# Altium schematic sheet Connectors.SchDoc: Frame13ProDock
size A3; DrawnBy: ExoticDG / Nova; SheetNumber: 3; SheetTotal: 5
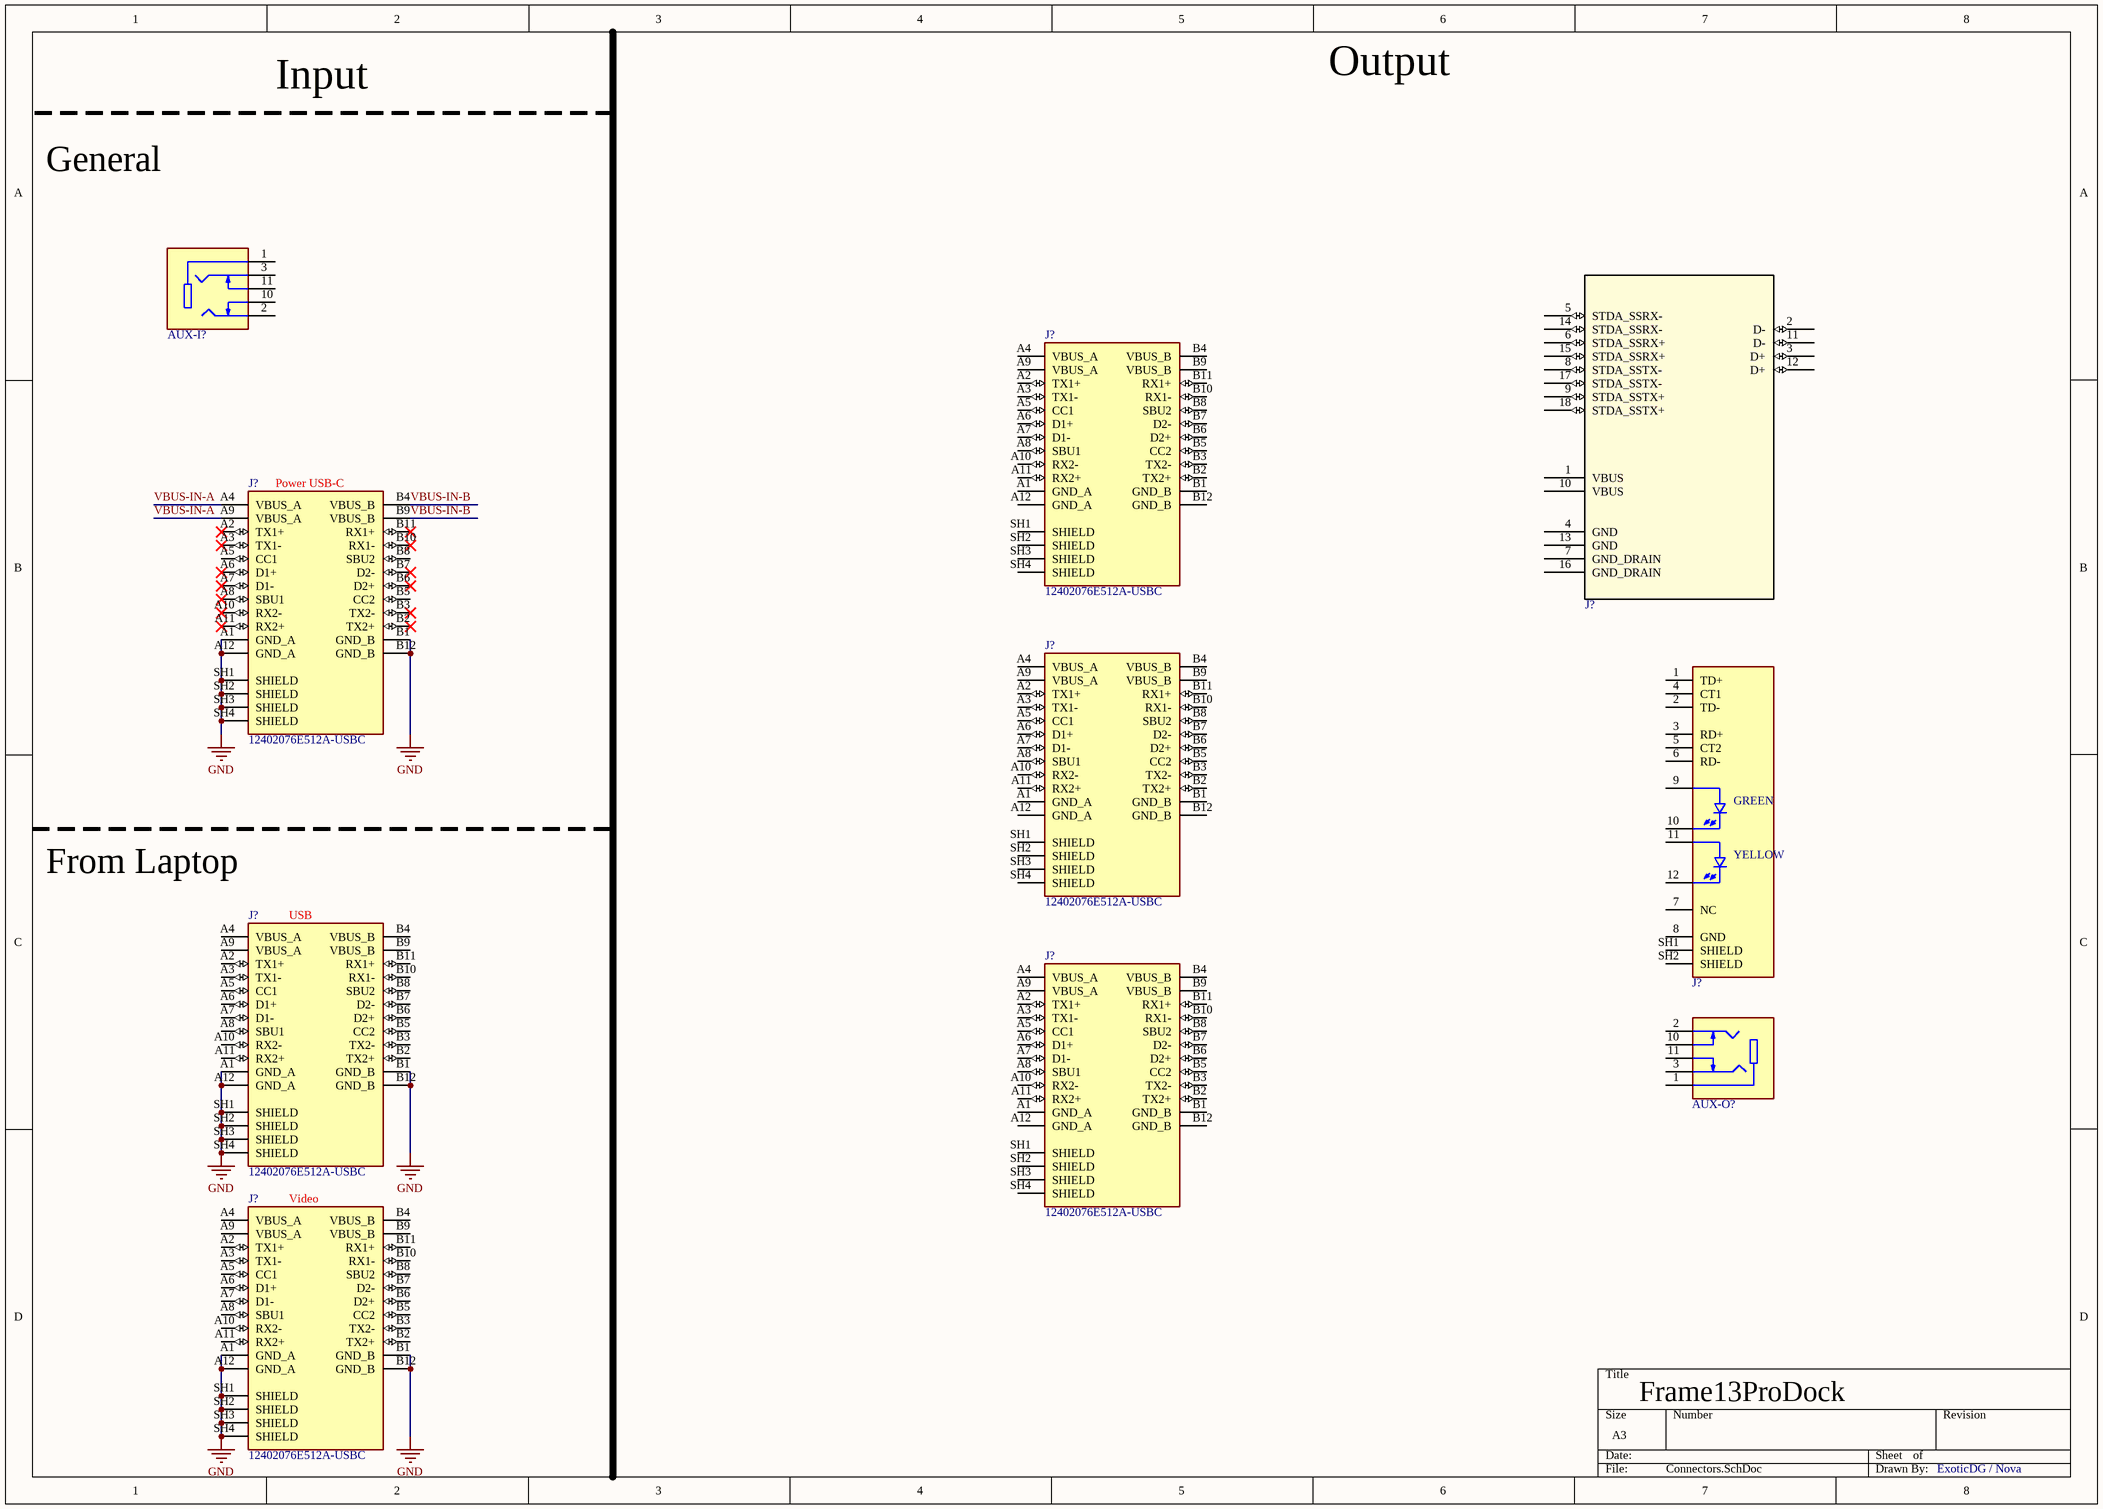
[diagram p0: Connectors.SchDoc]

## Parts
(Parts that share a designator on the sheet are numbered #1, #2 ... from top to bottom, then left to right.)
AUX-I?  SJ1-3525NG-PI  [SJ1-3525NG-PI]  (value not drawn)
AUX-O?  SJ1-3525NG-GR  [SJ1-3525NG-GR]  (value not drawn)
J?#1  0484060003-USBA-Dual-Stack  [0484060003-USBA-Dual-Stack]  (value not drawn)
J?#2  12402076E512A-USBC  [12402076E512A-USBC]
J?#3  12402076E512A-USBC  [12402076E512A-USBC]
J?#4  12402076E512A-USBC  [12402076E512A-USBC]
J?#5  ARJM11D7-009-AB-EW2-ETHERNET  [ARJM11D7-009-AB-EW2-ETHERNET]  (value not drawn)
J?#6  12402076E512A-USBC  [12402076E512A-USBC]
J?#7  12402076E512A-USBC  [12402076E512A-USBC]
J?#8  12402076E512A-USBC  [12402076E512A-USBC]

## Nets
GND: J?#3.A1(GND_A) J?#3.A12(GND_A) J?#3.B1(GND_B) J?#3.B12(GND_B) J?#3.SH1(SHIELD) J?#3.SH2(SHIELD) J?#3.SH3(SHIELD) J?#3.SH4(SHIELD) J?#6.A1(GND_A) J?#6.A12(GND_A) J?#6.B1(GND_B) J?#6.B12(GND_B) J?#6.SH1(SHIELD) J?#6.SH2(SHIELD) J?#6.SH3(SHIELD) J?#6.SH4(SHIELD) J?#8.A1(GND_A) J?#8.A12(GND_A) J?#8.B1(GND_B) J?#8.B12(GND_B) J?#8.SH1(SHIELD) J?#8.SH2(SHIELD) J?#8.SH3(SHIELD) J?#8.SH4(SHIELD)
VBUS-IN-A: J?#3.A4(VBUS_A) J?#3.A9(VBUS_A)
VBUS-IN-B: J?#3.B4(VBUS_B) J?#3.B9(VBUS_B)

Not connected (* = marked no-connect by the designer): AUX-I? 1 2 3 10 11; AUX-O? 1 2 3 10 11; J?#1 1(VBUS) 2(D-) 3(D+) 4(GND) 5(STDA_SSRX-) 6(STDA_SSRX+) 7(GND_DRAIN) 8(STDA_SSTX-) 9(STDA_SSTX+) 10(VBUS) 11(D-) 12(D+) 13(GND) 14(STDA_SSRX-) 15(STDA_SSRX+) 16(GND_DRAIN) 17(STDA_SSTX-) 18(STDA_SSTX+); J?#2 A1(GND_A) A2(TX1+) A3(TX1-) A4(VBUS_A) A5(CC1) A6(D1+) A7(D1-) A8(SBU1) A9(VBUS_A) A10(RX2-) A11(RX2+) A12(GND_A) B1(GND_B) B2(TX2+) B3(TX2-) B4(VBUS_B) B5(CC2) B6(D2+) B7(D2-) B8(SBU2) B9(VBUS_B) B10(RX1-) B11(RX1+) B12(GND_B) SH1(SHIELD) SH2(SHIELD) SH3(SHIELD) SH4(SHIELD); J?#3 A2(TX1+)* A3(TX1-)* A5(CC1) A6(D1+)* A7(D1-)* A8(SBU1)* A10(RX2-)* A11(RX2+)* B2(TX2+)* B3(TX2-)* B5(CC2) B6(D2+)* B7(D2-)* B8(SBU2) B10(RX1-)* B11(RX1+)*; J?#4 A1(GND_A) A2(TX1+) A3(TX1-) A4(VBUS_A) A5(CC1) A6(D1+) A7(D1-) A8(SBU1) A9(VBUS_A) A10(RX2-) A11(RX2+) A12(GND_A) B1(GND_B) B2(TX2+) B3(TX2-) B4(VBUS_B) B5(CC2) B6(D2+) B7(D2-) B8(SBU2) B9(VBUS_B) B10(RX1-) B11(RX1+) B12(GND_B) SH1(SHIELD) SH2(SHIELD) SH3(SHIELD) SH4(SHIELD); J?#5 1(TD+) 2(TD-) 3(RD+) 4(CT1) 5(CT2) 6(RD-) 7(NC) 8(GND) 9 10 11 12 SH1(SHIELD) SH2(SHIELD); J?#6 A2(TX1+) A3(TX1-) A4(VBUS_A) A5(CC1) A6(D1+) A7(D1-) A8(SBU1) A9(VBUS_A) A10(RX2-) A11(RX2+) B2(TX2+) B3(TX2-) B4(VBUS_B) B5(CC2) B6(D2+) B7(D2-) B8(SBU2) B9(VBUS_B) B10(RX1-) B11(RX1+); J?#7 A1(GND_A) A2(TX1+) A3(TX1-) A4(VBUS_A) A5(CC1) A6(D1+) A7(D1-) A8(SBU1) A9(VBUS_A) A10(RX2-) A11(RX2+) A12(GND_A) B1(GND_B) B2(TX2+) B3(TX2-) B4(VBUS_B) B5(CC2) B6(D2+) B7(D2-) B8(SBU2) B9(VBUS_B) B10(RX1-) B11(RX1+) B12(GND_B) SH1(SHIELD) SH2(SHIELD) SH3(SHIELD) SH4(SHIELD); J?#8 A2(TX1+) A3(TX1-) A4(VBUS_A) A5(CC1) A6(D1+) A7(D1-) A8(SBU1) A9(VBUS_A) A10(RX2-) A11(RX2+) B2(TX2+) B3(TX2-) B4(VBUS_B) B5(CC2) B6(D2+) B7(D2-) B8(SBU2) B9(VBUS_B) B10(RX1-) B11(RX1+)

## Notes on the sheet
- Input
- Output
- General
- (near J?#3) Power USB-C
- From Laptop
- (near J?#6) USB
- (near J?#8) Video
- (in symbol ARJM11D7-009-AB-EW2-ETHERNET) GREEN; YELLOW

## Library data of the parts
AUX-I? = SJ1-3525NG-PI: Stereo audio input via a 3.5mm AUX connector / 3.5 mm, Stereo, Right Angle, Through Hole, Isolated Ground, 3 Conductors, 2 Internal Switches, Audio Jack Connector / https://www.digikey.com/en/products/detail/same-sky-formerly-cui-devices/SJ1-3525NG-GR/2295990; ComponentLink1Description: Digikey; ComponentLink1URL: https://www.digikey.com/en/products/detail/same-sky-formerly-cui-devices/SJ1-3525NG-PI/2295991
AUX-O? = SJ1-3525NG-GR: Stereo audio output via a 3.5mm AUX connector / 3.5 mm, Stereo, Right Angle, Through Hole, Isolated Ground, 3 Conductors, 2 Internal Switches, Audio Jack Connector / https://www.digikey.com/en/products/detail/same-sky-formerly-cui-devices/SJ1-3525NG-GR/2295990; ComponentLink1Description: Digikey; ComponentLink1URL: https://www.digikey.com/en/products/detail/same-sky-formerly-cui-devices/SJ1-3525NG-GR/2295990
J?#1 = 0484060003-USBA-Dual-Stack: Universal Serial Bus (USB 3.0) I/O Receptacle, Dual Port Stacked, Right-Angle, Type A, High-Temperature Blue Nylon, 0.38Âµm Gold (Au) Plating, Contact Height 4.13mm; ComponentLink1Description: Digikey; ComponentLink1URL: https://www.digikey.com/en/products/detail/molex/0484060003/4701516
J?#2-J?#4 J?#6-J?#8 = 12402076E512A-USBC: USB CONN, 4.0 TYPE C, R/A RCPT, 24P, SMT; USB Connector Type: USB Type C; USB Standard: USB 4.0; Gender: Receptacle; No. of Positions: 24Positions; Connector Mounting: Surface Mount, Through Hole Mount; Or 79AJ9108; ComponentLink1Description: Digikey; ComponentLink1URL: https://www.digikey.com/en/products/detail/amphenol-cs-commercial-products/12402076E512A/15926893
J?#5 = ARJM11D7-009-AB-EW2-ETHERNET: ComponentLink1Description: Digikey; ComponentLink1URL: https://www.digikey.com/en/products/detail/abracon-llc/ARJM11D7-009-AB-EW2/7675229